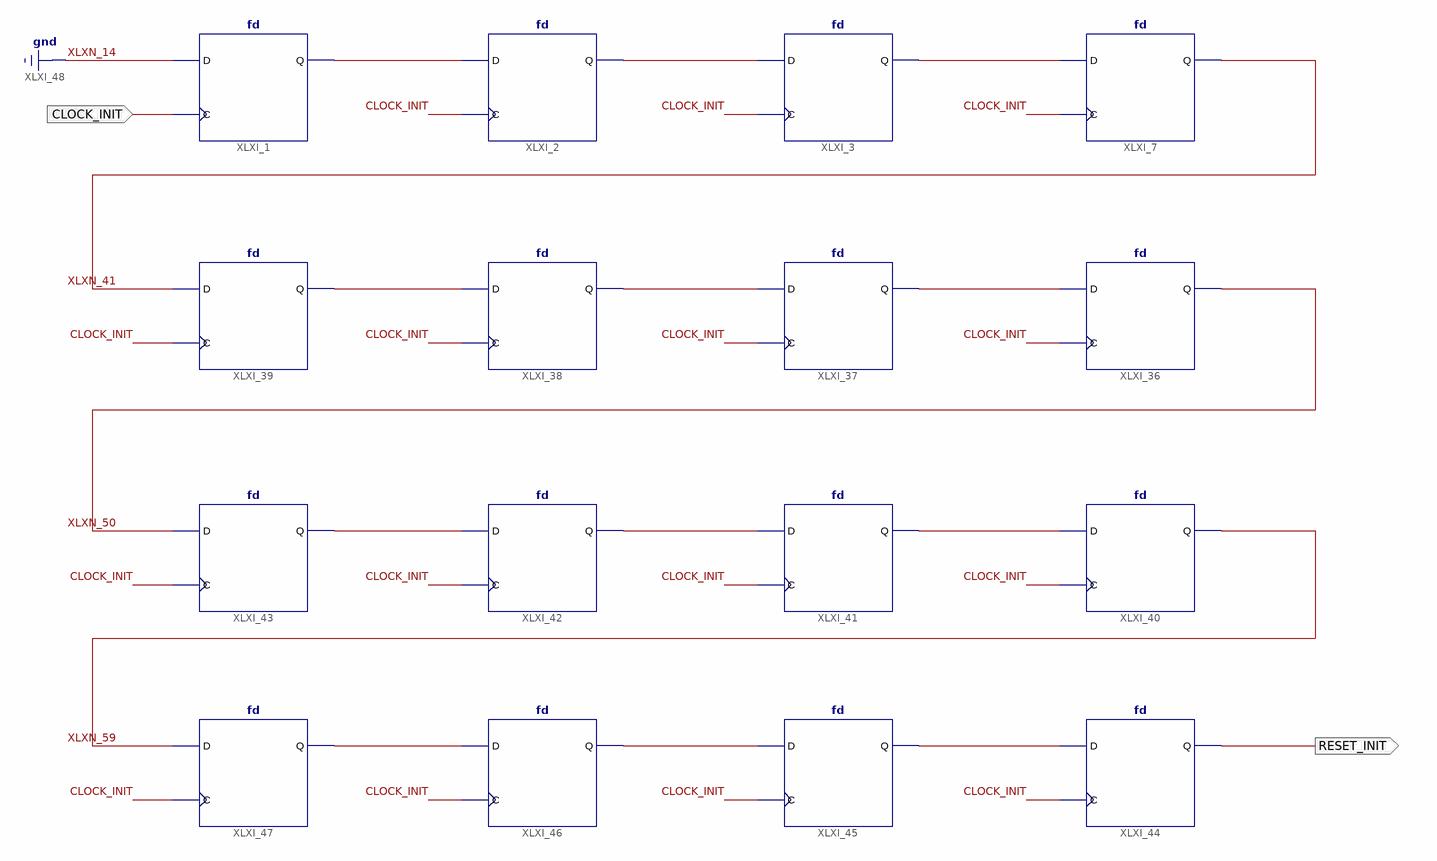
[diagram p0: schematic sheet 1]
// Xilinx ISE schematic RESET_INIT.sch (virtex4) as structural Verilog: 16 symbols, 2 ports
module RESET_INIT (
  input  CLOCK_INIT,
  output RESET_INIT
);

  wire XLXN_7, XLXN_8, XLXN_11, XLXN_36, XLXN_37, XLXN_39, XLXN_41, XLXN_45, XLXN_46, XLXN_48, XLXN_50,
       XLXN_54, XLXN_55, XLXN_57, XLXN_59;

  fd #(.INIT("1")) XLXI_7 (.C(CLOCK_INIT), .D(XLXN_7), .Q(XLXN_41));
  fd #(.INIT("1")) XLXI_3 (.C(CLOCK_INIT), .D(XLXN_8), .Q(XLXN_7));
  fd #(.INIT("1")) XLXI_2 (.C(CLOCK_INIT), .D(XLXN_11), .Q(XLXN_8));
  fd #(.INIT("1")) XLXI_1 (.C(CLOCK_INIT), .D(1'b0), .Q(XLXN_11));
  fd #(.INIT("1")) XLXI_36 (.C(CLOCK_INIT), .D(XLXN_36), .Q(XLXN_50));
  fd #(.INIT("1")) XLXI_37 (.C(CLOCK_INIT), .D(XLXN_37), .Q(XLXN_36));
  fd #(.INIT("1")) XLXI_38 (.C(CLOCK_INIT), .D(XLXN_39), .Q(XLXN_37));
  fd #(.INIT("1")) XLXI_39 (.C(CLOCK_INIT), .D(XLXN_41), .Q(XLXN_39));
  fd #(.INIT("1")) XLXI_40 (.C(CLOCK_INIT), .D(XLXN_45), .Q(XLXN_59));
  fd #(.INIT("1")) XLXI_41 (.C(CLOCK_INIT), .D(XLXN_46), .Q(XLXN_45));
  fd #(.INIT("1")) XLXI_42 (.C(CLOCK_INIT), .D(XLXN_48), .Q(XLXN_46));
  fd #(.INIT("1")) XLXI_43 (.C(CLOCK_INIT), .D(XLXN_50), .Q(XLXN_48));
  fd #(.INIT("1")) XLXI_44 (.C(CLOCK_INIT), .D(XLXN_54), .Q(RESET_INIT));
  fd #(.INIT("1")) XLXI_45 (.C(CLOCK_INIT), .D(XLXN_55), .Q(XLXN_54));
  fd #(.INIT("1")) XLXI_46 (.C(CLOCK_INIT), .D(XLXN_57), .Q(XLXN_55));
  fd #(.INIT("1")) XLXI_47 (.C(CLOCK_INIT), .D(XLXN_59), .Q(XLXN_57));
endmodule
